# Altium schematic sheet RotatingDUTframe.SchDoc
size Letter
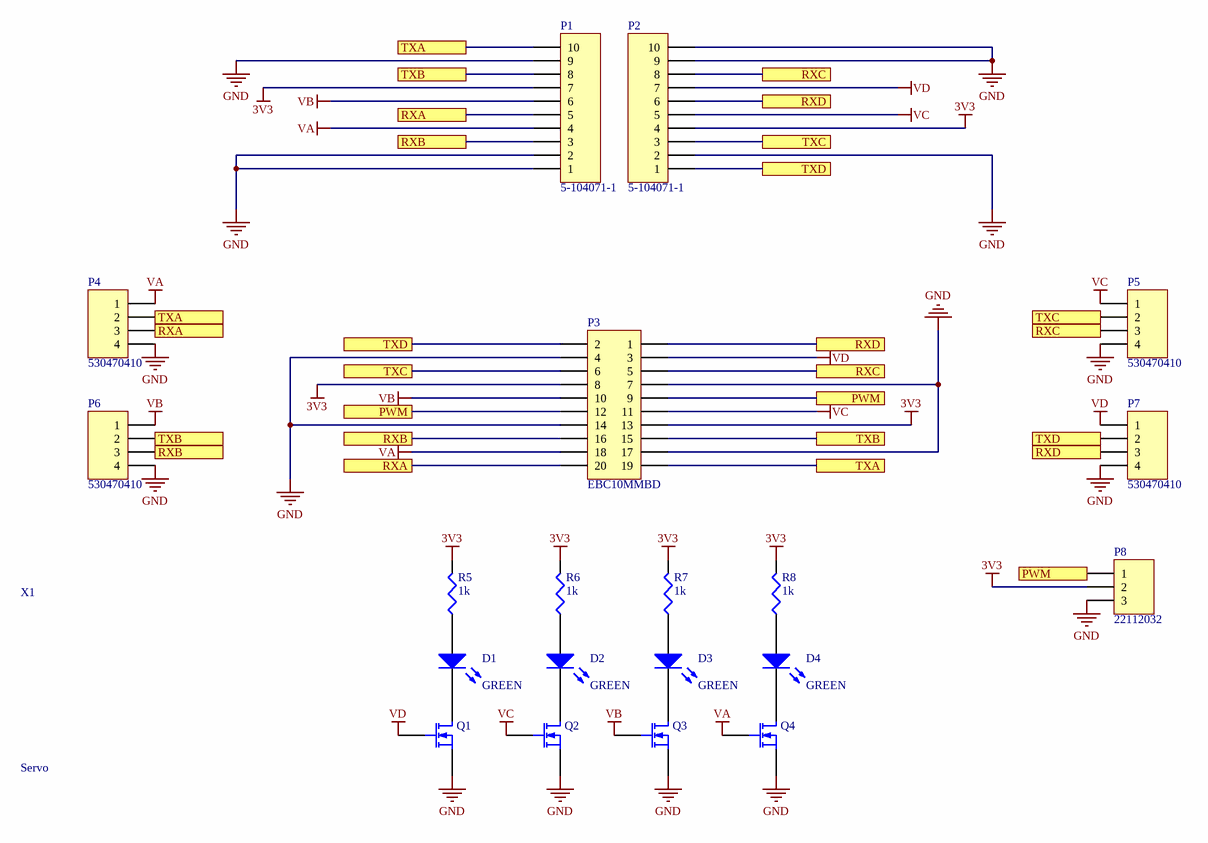
[diagram p0: RotatingDUTframe.SchDoc]

## Parts
D1  value GREEN  [WL-150060XS75000]  (hidden comment: LED)
D2  value GREEN  [WL-150060XS75000]  (hidden comment: LED)
D3  value GREEN  [WL-150060XS75000]  (hidden comment: LED)
D4  value GREEN  [WL-150060XS75000]  (hidden comment: LED)
P1  5-104071-1  [TEC-5-104071-1]
P2  5-104071-1  [TEC-5-104071-1]
P3  Manufacturer Part Number: EBC10MMBD  [SLN-EBC10MMBD]  (hidden comment: Header 10x2)
P4  Manufacturer Part Number: 530470410  [MOLX-530470410]  (hidden comment: Header 4)
P5  Manufacturer Part Number: 530470410  [MOLX-530470410]  (hidden comment: Header 4)
P6  Manufacturer Part Number: 530470410  [MOLX-530470410]  (hidden comment: Header 4)
P7  Manufacturer Part Number: 530470410  [MOLX-530470410]  (hidden comment: Header 4)
P8  Manufacturer Part Number: 22112032  [MOLX-22112032]  (hidden comment: Header 3)
Q1  SQ1470  [VSH-SQ1470AEH]  (value not drawn)
Q2  SQ1470  [VSH-SQ1470AEH]  (value not drawn)
Q3  SQ1470  [VSH-SQ1470AEH]  (value not drawn)
Q4  SQ1470  [VSH-SQ1470AEH]  (value not drawn)
R5  value 1k  [PANA-ERJ3EK]  (hidden comment: Res3)
R6  value 1k  [PANA-ERJ3EK]  (hidden comment: Res3)
R7  value 1k  [PANA-ERJ3EK]  (hidden comment: Res3)
R8  value 1k  [PANA-ERJ3EK]  (hidden comment: Res3)
X1  Servo  [Servo]

## Ports
PWM, RXA, RXB, RXC, RXD, TXA, TXB, TXC, TXD

## Nets
3V3: P1.7 P2.4 P3.8 P3.13 P8.2 R5.2 R6.2 R7.2 R8.2
GND: P1.1 P1.2 P1.9 P2.2 P2.9 P2.10 P3.4 P3.7 P3.14 P3.17 P4.4 P5.4 P6.4 P7.4 P8.3 Q1.3(S) Q2.3(S) Q3.3(S) Q4.3(S)
VA: P1.4 P3.18 P4.1 Q4.2(G)
VB: P1.6 P3.10 P6.1 Q3.2(G)
VC: P2.5 P3.11 P5.1 Q2.2(G)
VD: P2.7 P3.3 P7.1 Q1.2(G)
PWM: P3.9 P3.12 P8.1 ; port PWM
RXA: P1.5 P3.20 P4.3 ; port RXA
RXB: P1.3 P3.16 P6.3 ; port RXB
RXC: P2.8 P3.5 P5.3 ; port RXC
RXD: P2.6 P3.1 P7.3 ; port RXD
TXA: P1.10 P3.19 P4.2 ; port TXA
TXB: P1.8 P3.15 P6.2 ; port TXB
TXC: P2.3 P3.6 P5.2 ; port TXC
TXD: P2.1 P3.2 P7.2 ; port TXD
NetD1_1: D1.1(A) R5.1
NetD1_2: D1.2(K) Q1.1(D)
NetD2_1: D2.1(A) R6.1
NetD2_2: D2.2(K) Q2.1(D)
NetD3_1: D3.1(A) R7.1
NetD3_2: D3.2(K) Q3.1(D)
NetD4_1: D4.1(A) R8.1
NetD4_2: D4.2(K) Q4.1(D)

## Notes on the sheet
- (the "License"); you may not use or redistribute this file except in compliance with the License. You
- This file and the information within it are licensed under the terms of the Apache License, Version 2.0
- Copyright
- Unless required by applicable law or agreed to in writing, content distributed under the License is
- distributed on an "AS IS" BASIS, WITHOUT WARRANTIES OR CONDITIONS OF ANY KIND,
- either express or implied. See the License for the specific language governing permissions and
- limitations under the License.
- may obtain a copy of the License at:
- http://www.apache.org/licenses/LICENSE-2.0
- Title
- Size:
- Date:
- Letter
- Number:
- Time:
- Revision:
- Sheet
- of
- University of Alberta
- Deptartment of Electrical
- and Computer Engineering
- Edmonton AB, Canada
- T6G 1H9
- File:

## Library data of the parts
D1-D4 = 2: LED GREEN CLEAR 0603 SMD; Part Number: 2; Manufacturer Part Number: 150060GS75000; Designator: D?; Brightness: 430mcd; Published: 8-Jun-2000; LatestRevisionDate: 08-Jul-2005; LatestRevisionNote: Mech Layer 1 removed.; PackageReference: WL-150060XS75000; Publisher: Altium Limited; PackageDescription: LED; 2 Leads; Supplier Part Number 1: 732-4971-1-ND; Supplier 1: Digi-Key; Supplier Link: http://www.digikey.ca/product-search/en?keywords=732-4971-1-ND
P1 P2 = 458: CONN HEADER 10POS .050 VERT GOLD; Part Number: 458; Designator: P?; LatestRevisionDate: 17-Jul-2002; LatestRevisionNote: Re-released for DXP Platform.; Publisher: Altium Limited; Manufacturer Part Number: 5-104071-1; Supplier Part Number 1: 5-104071-1-ND; Supplier 1: Digi-Key; Supplier Link: http://www.digikey.ca/product-search/en?keywords=5-104071-1-ND
P3 = PP-SLN-00106: CONN CARDEDGE MALE 20POS 0.100; Index: 106; Designator: P?; Number of Positions: 20; Pitch: 0.100" (2.54mm); LatestRevisionDate: 2018-03-22; LatestRevisionNote: ...; Publisher: AlbertaSat; Part Number: PP-SLN-00106; Supplier Part Number 1: S7282-ND; Supplier 1: Digi-key; Published: 2018-03-22; PackageReference: SLN-EBC10MMBD; PackageDescription: CONN CARDEDGE MALE 20POS 0.100; Supplier Link: #https://www.digikey.ca/product-detail/en/sullins-connector-solutions/EBC10MMBD/S7282-ND/1922771#; Number of Rows: 2; Mounting Type: Through Hole
P4-P7 = 5: CONN HEADER 4POS 1.25MM VERT TIN; Part Number: 5; Designator: P?; LatestRevisionDate: 17-Jul-2002; LatestRevisionNote: Re-released for DXP Platform.; Publisher: Altium Limited; Supplier Part Number 1: WM1733-ND; Supplier 1: Digi-Key; Supplier Link: http://www.digikey.ca/product-search/en?keywords=WM1733-ND; PackageReference: MOLX-530470410
P8 = 33: CONN HEADER 3POS .100 VERT GOLD; Part Number: 33; Designator: P?; LatestRevisionDate: 17-Jul-2002; LatestRevisionNote: Re-released for DXP Platform.; Publisher: Altium Limited; Supplier Part Number 1: WM2701-ND; Supplier 1: Digi-Key; Supplier Link: http://www.digikey.ca/product-search/en?keywords=WM2701-ND; PackageReference: MOLX-22112032
Q1-Q4 = PQ-VSH-00227: MOSFET N-CH 30V 2.8A SC70; Manufacturer Part Number: SQ1470AEH-T1_GE3; Index: 227; Designator: Q?; Published: 7/12/2017; LatestRevisionDate: 7/12/2017; LatestRevisionNote: ...; PackageVersion: 1995/1996; PackageReference: VSH-SOT363; Publisher: AlbertaSat; PackageDescription: SOT23, 6-Leads, Body 2.00x2.10mm, Pitch 0.65mm, IPC Low Density; Part Number: PQ-VSH-00227; Supplier Part Number 1: SQ1470AEH-T1_GE3CT-ND; Supplier 1: Digi-key; Supplier Part Number 2: 78-SQ1470AEH-T1_GE3; Supplier 2: Mouser; Supplier Link: #https://www.digikey.ca/product-detail/en/vishay-siliconix/SQ1470AEH-T1_GE3/SQ1470AEH-T1_GE3CT-ND/6595360#; Applications: Automotive
R5-R8 = 15398: RES SMD 1K OHM 1% 1/10W 0603; Part Number: 15398; Manufacturer Part Number: ERJ-3EKF1001V; Designator: R?; Power: 0.1W, 1/10W; Temperature Coefficient: ±100ppm/°C; Published: 8-Jun-2000; LatestRevisionDate: 29-May-2009; LatestRevisionNote: IPC-7351 Footprint Added.; PackageReference: 0603 (1608 Metric); Publisher: Altium Limited; PackageDescription: Chip Resistor, 2-Leads, Body 1.60x0.80mm, IPC Low Density; Supplier Part Number 1: P1.00KHCT-ND; Supplier 1: Digi-Key; Supplier Link: http://www.digikey.ca/product-search/en?keywords=P1.00KHCT-ND; Tolerance: ±1%